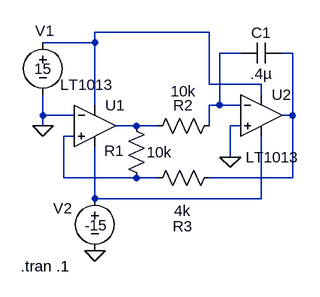
[diagram p0: schematic Triangle.asc]
Triangle.asc, the LTspice schematic file:
Version 4
SHEET 1 880 680
WIRE 272 0 96 0
WIRE 96 16 96 0
WIRE 96 16 16 16
WIRE 320 32 288 32
WIRE 400 32 384 32
WIRE 272 80 272 0
WIRE 352 80 272 80
WIRE 352 96 352 80
WIRE 96 112 96 16
WIRE 288 112 288 32
WIRE 288 112 272 112
WIRE 320 112 288 112
WIRE 16 128 16 96
WIRE 64 128 16 128
WIRE 400 128 400 32
WIRE 400 128 384 128
WIRE 16 144 16 128
WIRE 160 144 128 144
WIRE 192 144 160 144
WIRE 272 144 272 112
WIRE 320 144 304 144
WIRE 64 160 48 160
WIRE 304 192 304 144
WIRE 48 224 48 160
WIRE 160 224 48 224
WIRE 192 224 160 224
WIRE 400 224 400 128
WIRE 400 224 272 224
WIRE 96 256 96 176
WIRE 352 256 352 160
WIRE 352 256 96 256
FLAG 16 144 0
FLAG 304 192 0
FLAG 96 336 0
SYMBOL Opamps\\LT1013 96 80 R0
WINDOW 3 -53 1 Left 2
SYMATTR InstName U1
SYMBOL Opamps\\LT1013 352 64 R0
WINDOW 3 -24 128 Left 2
SYMATTR InstName U2
SYMBOL cap 384 16 R90
WINDOW 0 0 32 VBottom 2
WINDOW 3 32 32 VTop 2
SYMATTR InstName C1
SYMATTR Value .4µ
SYMBOL res 144 128 R0
WINDOW 0 -34 54 Left 2
WINDOW 3 32 57 Left 2
SYMATTR InstName R1
SYMATTR Value 10k
SYMBOL res 288 128 R90
WINDOW 0 0 56 VBottom 2
WINDOW 3 -53 56 VTop 2
SYMATTR InstName R2
SYMATTR Value 10k
SYMBOL res 288 208 R90
WINDOW 0 106 57 VBottom 2
WINDOW 3 51 57 VTop 2
SYMATTR InstName R3
SYMATTR Value 4k
SYMBOL voltage 16 0 R0
WINDOW 0 -12 -2 Left 2
WINDOW 3 -13 56 Left 2
WINDOW 123 0 0 Left 2
WINDOW 39 0 0 Left 2
SYMATTR InstName V1
SYMATTR Value 15
SYMBOL voltage 96 240 R0
WINDOW 0 -64 31 Left 2
WINDOW 3 -16 57 Left 2
WINDOW 123 0 0 Left 2
WINDOW 39 0 0 Left 2
SYMATTR InstName V2
SYMATTR Value -15
TEXT -18 360 Left 2 !.tran .1

The netlist it stands for:
* Triangle.asc
XU1 N005 0 N001 N006 N004 LT1013  ; pins In+ In- V+ V- OUT
XU2 0 N002 N001 N006 N003 LT1013  ; pins In+ In- V+ V- OUT
C1 N003 N002 .4µ
R1 N004 N005 10k
R2 N002 N004 10k
R3 N003 N005 4k
V1 N001 0 15
V2 N006 0 -15
.tran .1
.lib LTC.lib
.backanno
.end